# Altium schematic sheet RT-HOT.SchDoc
size A4
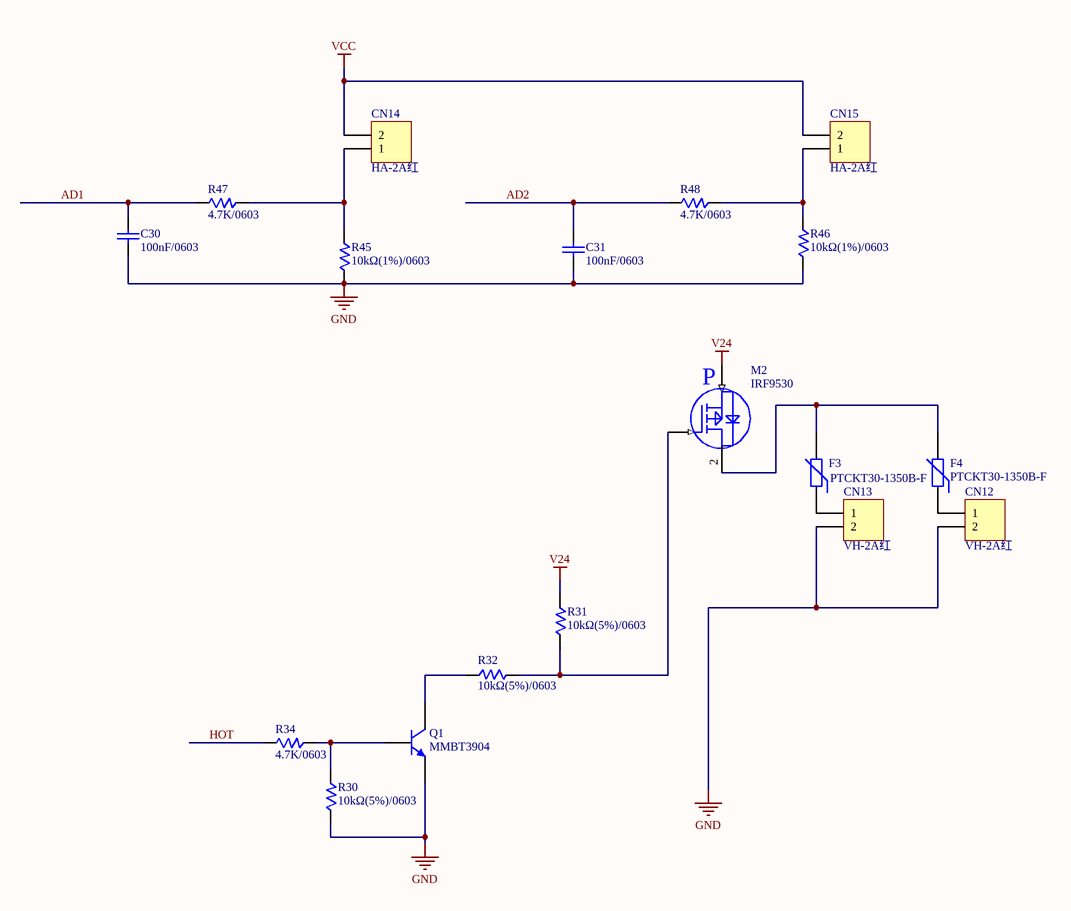
[diagram p0: RT-HOT.SchDoc]

## Parts
C30  100nF/0603  [0603C]
C31  100nF/0603  [0603C]
CN12  VH-2A红  [CON-VH-2P]
CN13  VH-2A红  [CON-VH-2P]
CN14  HA-2A红  [CON-XA-2P]
CN15  HA-2A红  [CON-XA-2P]
F3  PTCKT30-1350B-F  [FRAD0.2]
F4  PTCKT30-1350B-F  [FRAD0.2]
M2  IRF9530  [TO-220AB]
Q1  MMBT3904  [SOT-23-N]
R30  10kΩ(5%)/0603  [0603]
R31  10kΩ(5%)/0603  [0603]
R32  10kΩ(5%)/0603  [0603]
R34  4.7K/0603  [0603]
R45  10kΩ(1%)/0603  [0603]
R46  10kΩ(1%)/0603  [0603]
R47  4.7K/0603  [0603]
R48  4.7K/0603  [0603]

## Nets
GND: C30.2 C31.2 CN12.2 CN13.2 Q1.E R30.1 R45.1 R46.1
V24: M2.3(D) R31.2
VCC: CN14.2 CN15.2
AD1: C30.1 R47.1
AD2: C31.1 R48.1
HOT: R34.1
NetCN12_1: CN12.1 F4.1
NetCN13_1: CN13.1 F3.1
NetCN14_1: CN14.1 R45.2 R47.2
NetCN15_1: CN15.1 R46.2 R48.2
NetF3_2: F3.2 F4.2 M2.2(S)
NetM2_1: M2.1(G) R31.1 R32.1
NetQ1_B: Q1.B R30.2 R34.2
NetQ1_C: Q1.C R32.2

## Notes on the sheet
- (in symbol MP-IRF9530/环保) P

## Library data of the parts
C30 C31 = C0603/100nF: 物料名称: 贴片电容104M/(20%)/X7R/0603封装/环保; 物料编号: 1.01.25.056; 领料单位: 电子车间; 单位: 个; 仓库/库位: 内5X
CN12 CN13 = CON-VH-2A(红色): 物料名称: 大直脚VH-2A(红色)/环保; 物料编号: 1.01.57.502; 领料单位: 电子车间; 单位: 个; 仓库/库位: 内5X
CN14 CN15 = CON-HA-2A(红色): 物料名称: 带勾小直角HA-2A(红色）/环保; 物料编号: 1.01.57.928; 领料单位: 电子车间; 单位: 个; 仓库/库位: 内5X
F3 F4 = F-PTCKT30-1350B-F/环保: 物料名称: 自恢复保险PTCKT30-1350b-F/环保; 物料编号: 1.01.38.609; 领料单位: 电子车间; 单位: 个; 仓库/库位: 内5X
M2 = MP-IRF9530/环保: 物料名称: 场效应管(MOS管)IRF9530/环保; 物料编号: 1.01.40.003; 领料单位: 电子车间; 单位: 个; 仓库/库位: 内5X
Q1 = Q-MMBT3904/1AM-N: 物料名称: 贴片三极管1AM/MMBT3904/sot-23封装环保; 物料编号: 1.01.33.013; 领料单位: 电子车间; 单位: 个; 仓库/库位: 内5X
R30-R32 = R0603/10kΩ/(5%): 物料编号: 1.01.15.105; 物料名称: 贴片电阻10kΩ/(5%)0603封装/环保; 领料单位: 个; 仓库/库位: 内5X
R34 R47 R48 = R0603/4.7K/(5%): 物料编号: 1.01.15.115; 物料名称: 贴片电阻4.7K/(5%)/0603封装/环保; 领料单位: 电子车间; 单位: 个; 仓库/库位: 内5X
R45 R46 = R0603/10kΩ(1%): 物料编号: 1.01.15.112; 物料名称: 贴片电阻10kΩ(1%)/0603封装/环保; 领料单位: 电子车间; 单位: 个; 仓库/库位: 内5X